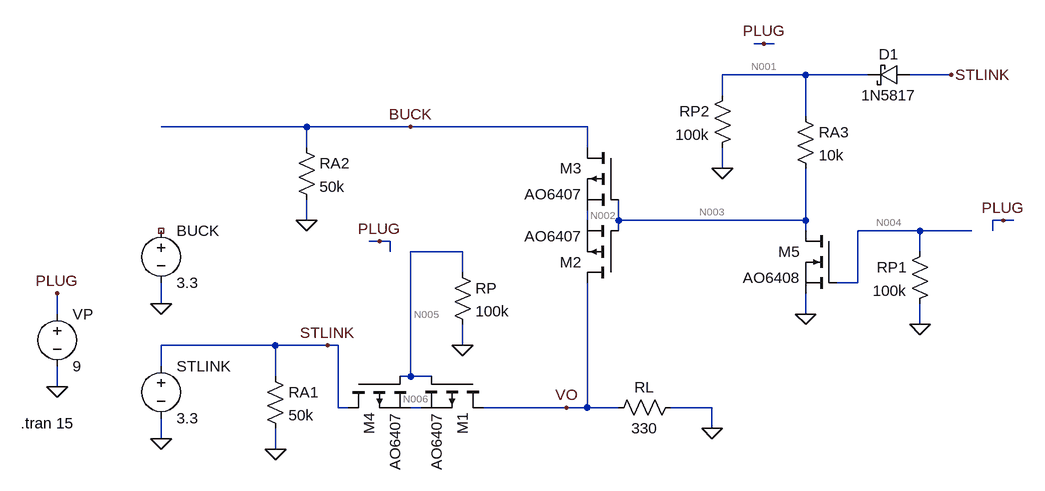
[diagram p0: schematic A3.asc]
A3.asc, the LTspice schematic file:
Version 4
SHEET 1 1560 680
WIRE 992 -224 976 -224
WIRE 1008 -224 992 -224
WIRE 1056 -176 928 -176
WIRE 1152 -176 1056 -176
WIRE 1280 -176 1216 -176
WIRE 928 -144 928 -176
WIRE 1056 -112 1056 -176
WIRE 288 -96 64 -96
WIRE 448 -96 288 -96
WIRE 720 -96 448 -96
WIRE 288 -64 288 -96
WIRE 720 -64 720 -96
WIRE 928 -32 928 -64
WIRE 288 48 288 16
WIRE 720 48 720 32
WIRE 768 48 768 16
WIRE 1056 48 1056 -32
WIRE 1056 48 768 48
WIRE 1360 48 1344 48
WIRE 1376 48 1360 48
WIRE 768 64 768 48
WIRE 1056 64 1056 48
WIRE 1232 64 1136 64
WIRE 1312 64 1232 64
WIRE 1344 64 1344 48
WIRE 400 80 384 80
WIRE 416 80 400 80
WIRE 416 96 416 80
WIRE 528 96 448 96
WIRE 1232 96 1232 64
WIRE 528 128 528 96
WIRE 1136 144 1136 64
WIRE 1136 144 1104 144
WIRE 64 176 64 144
WIRE -96 192 -96 160
WIRE 1056 192 1056 160
WIRE 1232 208 1232 176
WIRE 240 240 64 240
WIRE 320 240 240 240
WIRE 336 240 320 240
WIRE 528 240 528 208
WIRE 64 272 64 240
WIRE 240 288 240 240
WIRE 448 288 448 96
WIRE 448 288 432 288
WIRE 480 288 448 288
WIRE -96 304 -96 272
WIRE 336 336 336 240
WIRE 352 336 336 336
WIRE 464 336 448 336
WIRE 688 336 560 336
WIRE 720 336 720 144
WIRE 720 336 688 336
WIRE 768 336 720 336
WIRE 912 336 848 336
WIRE 912 368 912 336
WIRE 64 384 64 352
WIRE 240 400 240 368
FLAG -96 304 0
FLAG 64 384 0
FLAG 64 176 0
FLAG 912 368 0
FLAG -96 160 PLUG
FLAG 528 240 0
FLAG 400 80 PLUG
FLAG 688 336 VO
FLAG 448 -96 BUCK
FLAG 320 240 STLINK
FLAG 240 400 0
FLAG 288 48 0
FLAG 1056 192 0
FLAG 1232 208 0
FLAG 1360 48 PLUG
FLAG 928 -32 0
FLAG 992 -224 PLUG
FLAG 1280 -176 STLINK
SYMBOL voltage 64 48 R0
WINDOW 123 0 0 Left 0
WINDOW 39 0 0 Left 0
SYMATTR InstName BUCK
SYMATTR Value 3.3
SYMBOL voltage 64 256 R0
WINDOW 123 0 0 Left 0
WINDOW 39 0 0 Left 0
SYMATTR InstName STLINK
SYMATTR Value 3.3
SYMBOL voltage -96 176 R0
WINDOW 123 0 0 Left 0
WINDOW 39 0 0 Left 0
SYMATTR InstName VP
SYMATTR Value 9
SYMBOL pmos 560 288 R90
SYMATTR InstName M1
SYMATTR Value AO6407
SYMBOL pmos 768 144 R180
SYMATTR InstName M2
SYMATTR Value AO6407
SYMBOL res 864 320 R90
WINDOW 0 0 56 VBottom 2
WINDOW 3 32 56 VTop 2
SYMATTR InstName RL
SYMATTR Value 330
SYMBOL res 512 112 R0
SYMATTR InstName RP
SYMATTR Value 100k
SYMBOL pmos 768 -64 M0
SYMATTR InstName M3
SYMATTR Value AO6407
SYMBOL pmos 352 288 M90
SYMATTR InstName M4
SYMATTR Value AO6407
SYMBOL res 224 272 R0
SYMATTR InstName RA1
SYMATTR Value 50k
SYMBOL res 272 -80 R0
SYMATTR InstName RA2
SYMATTR Value 50k
SYMBOL nmos 1104 64 M0
SYMATTR InstName M5
SYMATTR Value AO6408
SYMBOL res 1248 80 M0
SYMATTR InstName RP1
SYMATTR Value 100k
SYMBOL res 1040 -128 R0
SYMATTR InstName RA3
SYMATTR Value 10k
SYMBOL res 944 -160 M0
SYMATTR InstName RP2
SYMATTR Value 100k
SYMBOL schottky 1216 -192 R90
WINDOW 0 0 32 VBottom 2
WINDOW 3 32 32 VTop 2
SYMATTR InstName D1
SYMATTR Value 1N5817
SYMATTR Description Diode
SYMATTR Type diode
TEXT -152 360 Left 2 !.tran 15

The netlist it stands for:
* A3.asc
V§BUCK NC_01 0 3.3
V§STLINK STLINK 0 3.3
VP PLUG 0 9
M1 VO N005 N006 N006 AO6407
M2 VO N003 N002 N002 AO6407
RL 0 VO 330
RP N005 0 100k
M3 BUCK N003 N002 N002 AO6407
M4 STLINK N005 N006 N006 AO6407
RA1 STLINK 0 50k
RA2 BUCK 0 50k
M5 N003 N004 0 0 AO6408
RP1 N004 0 100k
RA3 N001 N003 10k
RP2 N001 0 100k
D1 STLINK N001 1N5817
.model D D
.lib standard.dio
.model NMOS NMOS
.model PMOS PMOS
.lib standard.mos
.tran 15
.backanno
.end

* Results of the author's LTspice run, read from the files saved beside the schematic
* Operating Point, zero values left out:
*   V(stlink) = 3.3 V
*   V(plug) = 9 V
*   V(vo) = 3.299 V
*   V(n006) = 3.3 V
*   V(n003) = 3.275 V
*   V(n002) = 3.299 V
*   V(buck) = 1.47 mV
*   V(n001) = 3.275 V
*   Id(M1) = -9.998 mA
*   Is(M1) = 9.998 mA
*   Id(M2) = 29.37 nA
*   Is(M2) = -29.37 nA
*   Id(M3) = -29.39 nA
*   Is(M3) = 29.39 nA
*   Id(M4) = 9.998 mA
*   Is(M4) = -9.998 mA
*   Id(M5) = 966.7 pA
*   Is(M5) = -966.7 pA
*   I(D1) = 32.75 µA
*   I(Rl) = -9.998 mA
*   I(Ra1) = 66 µA
*   I(Ra2) = 29.4 nA
*   I(Ra3) = 970 pA
*   I(Rp2) = 32.75 µA
*   I(Stlink) = -10.1 mA
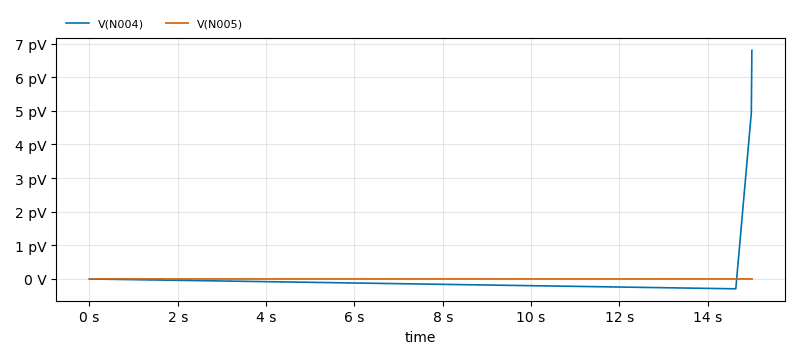
[diagram p1: Transient Analysis of A3.asc, plotted from the saved traces]
* Transient Analysis, 1 run:
*   V(N004): min -292.3 fV, max 6.796 pV, average -83.29 fV, rms 598.2 fV, last 6.796 pV
*   V(N005): min -0.00255 fV, max 0.05592 fV, average -0.0008562 fV, rms 0.004168 fV, last 0.05592 fV